# Altium schematic sheet RK3566_DDR3.SchDoc
size A3; SheetNumber: 2; SheetTotal: 6
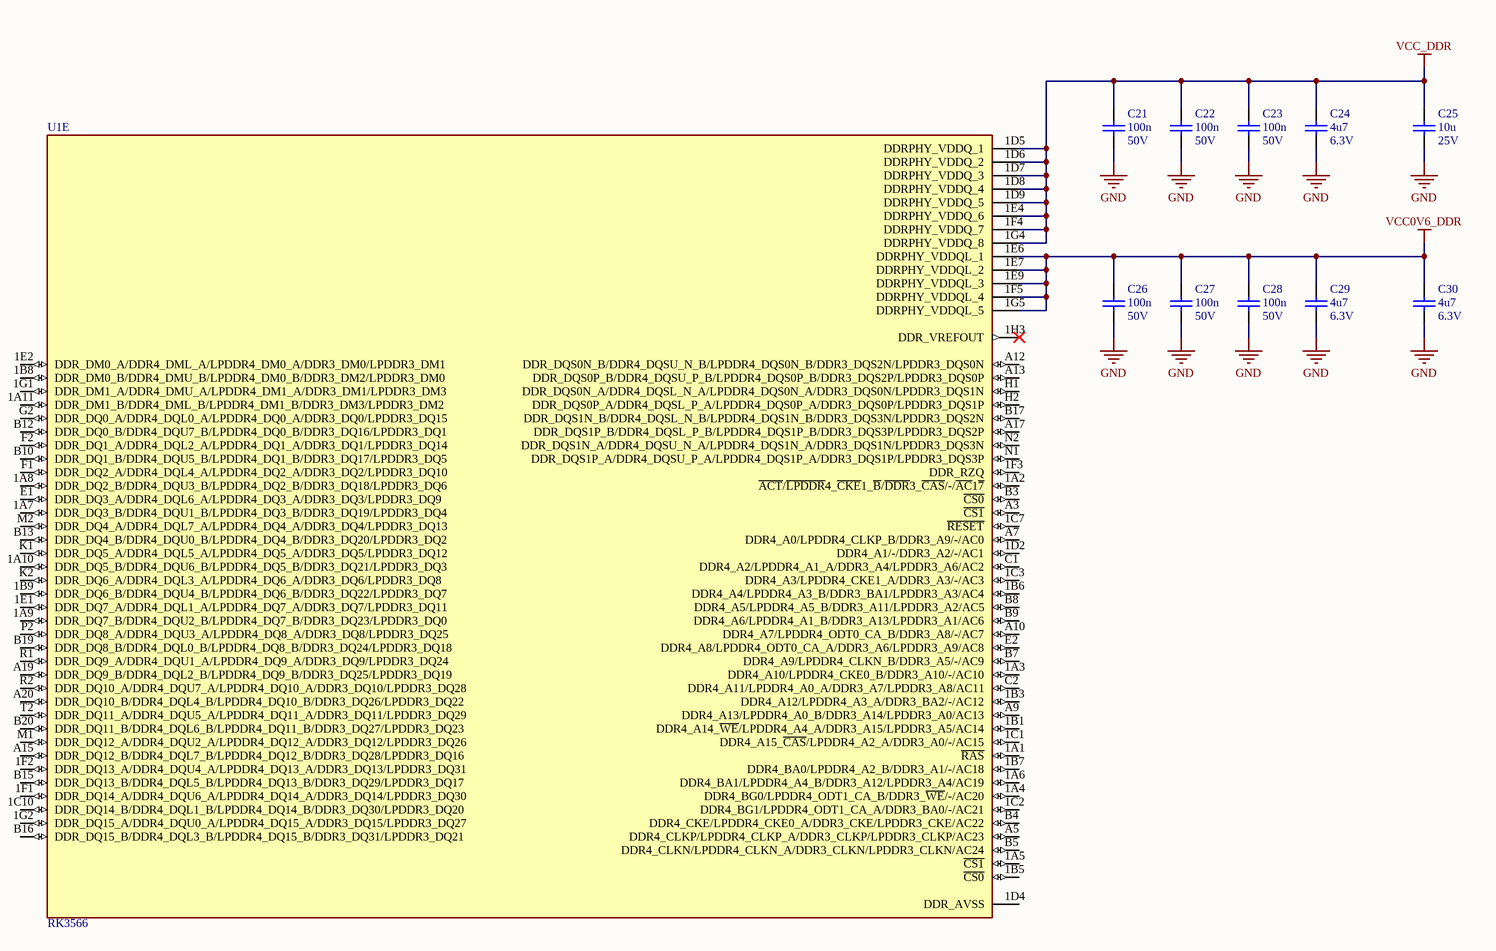
[diagram p0: RK3566_DDR3.SchDoc]

## Parts
C21  value 100n  Voltage: 50V  (hidden comment: GRM155R71H104KE14D)
C22  value 100n  Voltage: 50V  (hidden comment: GRM155R71H104KE14D)
C23  value 100n  Voltage: 50V  (hidden comment: GRM155R71H104KE14D)
C24  value 4u7  Voltage: 6.3V  (hidden comment: GRM155R60J475ME47D)
C25  value 10u  Voltage: 25V  (hidden comment: GRM188R61E106MA73D)
C26  value 100n  Voltage: 50V  (hidden comment: GRM155R71H104KE14D)
C27  value 100n  Voltage: 50V  (hidden comment: GRM155R71H104KE14D)
C28  value 100n  Voltage: 50V  (hidden comment: GRM155R71H104KE14D)
C29  value 4u7  Voltage: 6.3V  (hidden comment: GRM155R60J475ME47D)
C30  value 4u7  Voltage: 6.3V  (hidden comment: GRM155R60J475ME47D)
U1  RK3566  [RK3566]  (part E of 9)

## Nets
GND: C21.2 C22.2 C23.2 C24.2 C25.2 C26.2 C27.2 C28.2 C29.2 C30.2
VCC0V6_DDR: C26.1 C27.1 C28.1 C29.1 C30.1 U1.1E6(DDRPHY_VDDQL_1) U1.1E7(DDRPHY_VDDQL_2) U1.1E9(DDRPHY_VDDQL_3) U1.1F5(DDRPHY_VDDQL_4) U1.1G5(DDRPHY_VDDQL_5)
VCC_DDR: C21.1 C22.1 C23.1 C24.1 C25.1 U1.1D5(DDRPHY_VDDQ_1) U1.1D6(DDRPHY_VDDQ_2) U1.1D7(DDRPHY_VDDQ_3) U1.1D8(DDRPHY_VDDQ_4) U1.1D9(DDRPHY_VDDQ_5) U1.1E4(DDRPHY_VDDQ_6) U1.1F4(DDRPHY_VDDQ_7) U1.1G4(DDRPHY_VDDQ_8)

Not connected (* = marked no-connect by the designer): U1 1A1(~{RAS}) 1A2(~{ACT}/~{LPDDR}4_~{CKE}1_~{B}/~{DDR}3_~{CAS}/-/~{AC}1~{7}) 1A3(DDR4_A10/LPDDR4_CKE0_B/DDR3_A10/-/AC10) 1A4(DDR4_BG0/LPDDR4_ODT1_CA_B/DDR3_~{WE}/-/AC20) 1A5(~{CS1}) 1A6(DDR4_BA1/LPDDR4_A4_B/DDR3_A12/LPDDR3_A4/AC19) 1A7(DDR_DQ3_B/DDR4_DQU1_B/LPDDR4_DQ3_B/DDR3_DQ19/LPDDR3_DQ4) 1A8(DDR_DQ2_B/DDR4_DQU3_B/LPDDR4_DQ2_B/DDR3_DQ18/LPDDR3_DQ6) 1A9(DDR_DQ7_B/DDR4_DQU2_B/LPDDR4_DQ7_B/DDR3_DQ23/LPDDR3_DQ0) 1A10(DDR_DQ5_B/DDR4_DQU6_B/LPDDR4_DQ5_B/DDR3_DQ21/LPDDR3_DQ3) 1A11(DDR_DM1_B/DDR4_DML_B/LPDDR4_DM1_B/DDR3_DM3/LPDDR3_DM2) 1B1(DDR4_A14_~{WE}/LPDDR4_A4_A/DDR3_A15/LPDDR3_A5/AC14) 1B3(DDR4_A12/LPDDR4_A3_A/DDR3_BA2/-/AC12) 1B5(~{CS0}) 1B6(DDR4_A4/LPDDR4_A3_B/DDR3_BA1/LPDDR3_A3/AC4) 1B7(DDR4_BA0/LPDDR4_A2_B/DDR3_A1/-/AC18) 1B8(DDR_DM0_B/DDR4_DMU_B/LPDDR4_DM0_B/DDR3_DM2/LPDDR3_DM0) 1B9(DDR_DQ6_B/DDR4_DQU4_B/LPDDR4_DQ6_B/DDR3_DQ22/LPDDR3_DQ7) 1C1(DDR4_A15_~{CAS}/LPDDR4_A2_A/DDR3_A0/-/AC15) 1C2(DDR4_BG1/LPDDR4_ODT1_CA_A/DDR3_BA0/-/AC21) 1C3(DDR4_A3/LPDDR4_CKE1_A/DDR3_A3/-/AC3) 1C7(~{RESET}) 1C10(DDR_DQ14_B/DDR4_DQL1_B/LPDDR4_DQ14_B/DDR3_DQ30/LPDDR3_DQ20) 1D2(DDR4_A1/-/DDR3_A2/-/AC1) 1D4(DDR_AVSS) 1E1(DDR_DQ7_A/DDR4_DQL1_A/LPDDR4_DQ7_A/DDR3_DQ7/LPDDR3_DQ11) 1E2(DDR_DM0_A/DDR4_DML_A/LPDDR4_DM0_A/DDR3_DM0/LPDDR3_DM1) 1F1(DDR_DQ14_A/DDR4_DQU6_A/LPDDR4_DQ14_A/DDR3_DQ14/LPDDR3_DQ30) 1F2(DDR_DQ13_A/DDR4_DQU4_A/LPDDR4_DQ13_A/DDR3_DQ13/LPDDR3_DQ31) 1F3(DDR_RZQ) 1G1(DDR_DM1_A/DDR4_DMU_A/LPDDR4_DM1_A/DDR3_DM1/LPDDR3_DM3) 1G2(DDR_DQ15_A/DDR4_DQU0_A/LPDDR4_DQ15_A/DDR3_DQ15/LPDDR3_DQ27) 1H3(DDR_VREFOUT)* A3(~{CS1}) A5(DDR4_CLKP/LPDDR4_CLKP_A/DDR3_CLKP/LPDDR3_CLKP/AC23) A7(DDR4_A0/LPDDR4_CLKP_B/DDR3_A9/-/AC0) A9(DDR4_A13/LPDDR4_A0_B/DDR3_A14/LPDDR3_A0/AC13) A10(DDR4_A7/LPDDR4_ODT0_CA_B/DDR3_A8/-/AC7) A12(DDR_DQS0N_B/DDR4_DQSU_N_B/LPDDR4_DQS0N_B/DDR3_DQS2N/LPDDR3_DQS0N) A13(DDR_DQS0P_B/DDR4_DQSU_P_B/LPDDR4_DQS0P_B/DDR3_DQS2P/LPDDR3_DQS0P) A15(DDR_DQ12_B/DDR4_DQL7_B/LPDDR4_DQ12_B/DDR3_DQ28/LPDDR3_DQ16) A17(DDR_DQS1P_B/DDR4_DQSL_P_B/LPDDR4_DQS1P_B/DDR3_DQS3P/LPDDR3_DQS2P) A19(DDR_DQ9_B/DDR4_DQL2_B/LPDDR4_DQ9_B/DDR3_DQ25/LPDDR3_DQ19) A20(DDR_DQ10_B/DDR4_DQL4_B/LPDDR4_DQ10_B/DDR3_DQ26/LPDDR3_DQ22) B3(~{CS0}) B4(DDR4_CKE/LPDDR4_CKE0_A/DDR3_CKE/LPDDR3_CKE/AC22) B5(DDR4_CLKN/LPDDR4_CLKN_A/DDR3_CLKN/LPDDR3_CLKN/AC24) B7(DDR4_A9/LPDDR4_CLKN_B/DDR3_A5/-/AC9) B8(DDR4_A5/LPDDR4_A5_B/DDR3_A11/LPDDR3_A2/AC5) B9(DDR4_A6/LPDDR4_A1_B/DDR3_A13/LPDDR3_A1/AC6) B10(DDR_DQ1_B/DDR4_DQU5_B/LPDDR4_DQ1_B/DDR3_DQ17/LPDDR3_DQ5) B12(DDR_DQ0_B/DDR4_DQU7_B/LPDDR4_DQ0_B/DDR3_DQ16/LPDDR3_DQ1) B13(DDR_DQ4_B/DDR4_DQU0_B/LPDDR4_DQ4_B/DDR3_DQ20/LPDDR3_DQ2) B15(DDR_DQ13_B/DDR4_DQL5_B/LPDDR4_DQ13_B/DDR3_DQ29/LPDDR3_DQ17) B16(DDR_DQ15_B/DDR4_DQL3_B/LPDDR4_DQ15_B/DDR3_DQ31/LPDDR3_DQ21) B17(DDR_DQS1N_B/DDR4_DQSL_N_B/LPDDR4_DQS1N_B/DDR3_DQS3N/LPDDR3_DQS2N) B19(DDR_DQ8_B/DDR4_DQL0_B/LPDDR4_DQ8_B/DDR3_DQ24/LPDDR3_DQ18) B20(DDR_DQ11_B/DDR4_DQL6_B/LPDDR4_DQ11_B/DDR3_DQ27/LPDDR3_DQ23) C1(DDR4_A2/LPDDR4_A1_A/DDR3_A4/LPDDR3_A6/AC2) C2(DDR4_A11/LPDDR4_A0_A/DDR3_A7/LPDDR3_A8/AC11) E1(DDR_DQ3_A/DDR4_DQL6_A/LPDDR4_DQ3_A/DDR3_DQ3/LPDDR3_DQ9) E2(DDR4_A8/LPDDR4_ODT0_CA_A/DDR3_A6/LPDDR3_A9/AC8) F1(DDR_DQ2_A/DDR4_DQL4_A/LPDDR4_DQ2_A/DDR3_DQ2/LPDDR3_DQ10) F2(DDR_DQ1_A/DDR4_DQL2_A/LPDDR4_DQ1_A/DDR3_DQ1/LPDDR3_DQ14) G2(DDR_DQ0_A/DDR4_DQL0_A/LPDDR4_DQ0_A/DDR3_DQ0/LPDDR3_DQ15) H1(DDR_DQS0N_A/DDR4_DQSL_N_A/LPDDR4_DQS0N_A/DDR3_DQS0N/LPDDR3_DQS1N) H2(DDR_DQS0P_A/DDR4_DQSL_P_A/LPDDR4_DQS0P_A/DDR3_DQS0P/LPDDR3_DQS1P) K1(DDR_DQ5_A/DDR4_DQL5_A/LPDDR4_DQ5_A/DDR3_DQ5/LPDDR3_DQ12) K2(DDR_DQ6_A/DDR4_DQL3_A/LPDDR4_DQ6_A/DDR3_DQ6/LPDDR3_DQ8) M1(DDR_DQ12_A/DDR4_DQU2_A/LPDDR4_DQ12_A/DDR3_DQ12/LPDDR3_DQ26) M2(DDR_DQ4_A/DDR4_DQL7_A/LPDDR4_DQ4_A/DDR3_DQ4/LPDDR3_DQ13) N1(DDR_DQS1P_A/DDR4_DQSU_P_A/LPDDR4_DQS1P_A/DDR3_DQS1P/LPDDR3_DQS3P) N2(DDR_DQS1N_A/DDR4_DQSU_N_A/LPDDR4_DQS1N_A/DDR3_DQS1N/LPDDR3_DQS3N) P2(DDR_DQ8_A/DDR4_DQU3_A/LPDDR4_DQ8_A/DDR3_DQ8/LPDDR3_DQ25) R1(DDR_DQ9_A/DDR4_DQU1_A/LPDDR4_DQ9_A/DDR3_DQ9/LPDDR3_DQ24) R2(DDR_DQ10_A/DDR4_DQU7_A/LPDDR4_DQ10_A/DDR3_DQ10/LPDDR3_DQ28) T2(DDR_DQ11_A/DDR4_DQU5_A/LPDDR4_DQ11_A/DDR3_DQ11/LPDDR3_DQ29)

## Library data of the parts
C21-C23 C26-C28 = GRM155R71H104KE14D: CAP 100N 50V X7R 0402; Size: 0402; Dielectric: X7R
C24 C29 C30 = GRM155R60J475ME47D: CAP 4.7U 6.3V X5R 0402; Size: 0402; Dielectric: X5R
C25 = GRM188R61E106MA73D: CAP 10U 25V X5R 0603; Size: 0603; Dielectric: X5R
U1 = RK3566: high-performance and low-power quad-core application processor; MF: Fuzhou Rockchip Electronics Co; SnapEDA_Link: https://www.snapeda.com/parts/RK3566/Fuzhou+Rockchip+Electronics+Co/view-part/?ref=snap; Package: None; Value: *; MP: RK3566; Check_prices: https://www.snapeda.com/parts/RK3566/Fuzhou+Rockchip+Electronics+Co/view-part/?ref=eda